# Altium schematic sheet SIM800C_V1.2.SchDoc
size A4
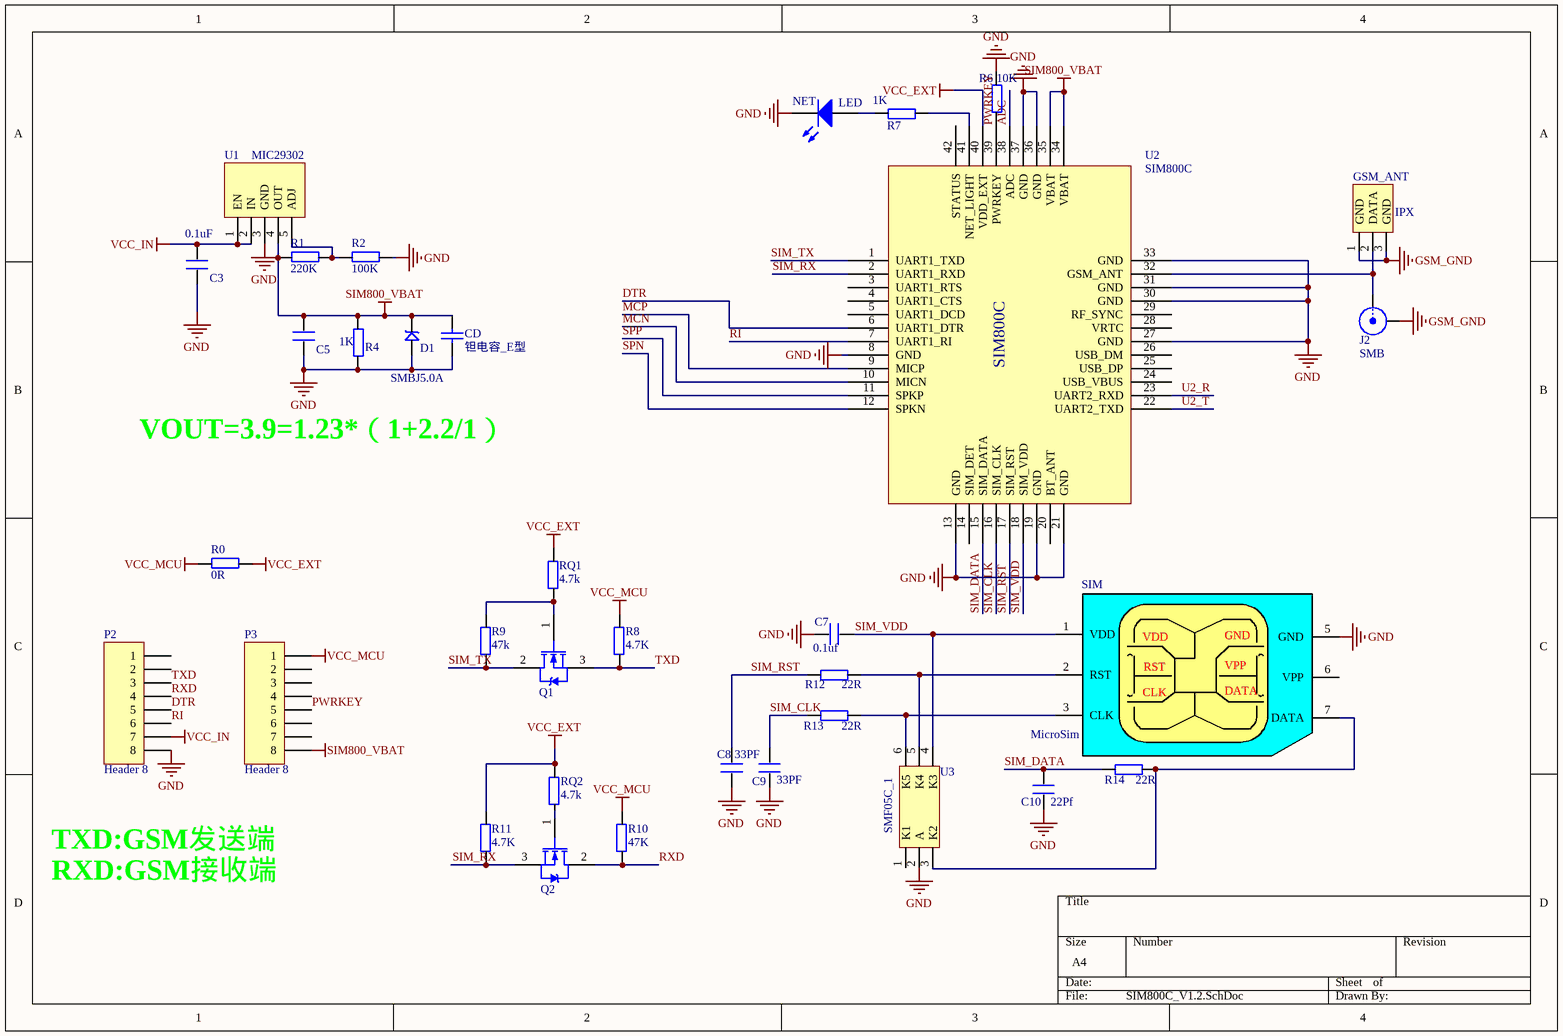
[diagram p0: SIM800C_V1.2.SchDoc]

## Parts
C3  0.1uF  [0603P]
C5  0.1uF  [0603P]  (value not drawn)
C7  0.1uf  [0603P]
C8  22UF  [0603P]  (value not drawn)
C9  22UF  [0603P]  (value not drawn)
C10  22Pf  [0603P]
CD  钽电容_E型  [钽电容_E型]
D1  SMBJ5.0A  [SMBJ]
GSM_ANT  IPX  [IPX]
J2  SMB  [SMB_V-RJ45]
NET  LED  [SMDLED]
P2  Header 8  [HDR1X8]
P3  Header 8  [HDR1X8]
Q1  NMOS-2  [SOT-23]  (value not drawn)
Q2  NMOS-2  [SOT-23]  (value not drawn)
R0  0R  [0603P]
R1  220K  [0603P]
R2  100K  [0603P]
R4  1K  [0603P]
R6  10K  [0603P]
R7  1K  [0603P]
R8  4.7K  [0603P]
R9  47k  [0603P]
R10  47K  [0603P]
R11  4.7K  [0603P]
R12  22R  [0603P]
R13  22R  [0603P]
R14  22R  [0603P]
RQ1  4.7k  [0603P]
RQ2  4.7k  [0603P]
SIM  MicroSim  [SIM卡 自弹]
U1  MIC29302  [D2PAK]
U2  SIM800C  [SIM800C]
U3  SMF05C_1  [SOT-363]

## Nets
GND: C3.1 C5.2 C7.1 C8.1 C9.1 C10.1 CD.1 D1.1 NET.2(K) P2.8 R2.1 R4.1 R6.2 SIM.5(GND) U1.3(GND) U2.8(GND) U2.13(GND) U2.19(GND) U2.21(GND) U2.27(GND) U2.30(GND) U2.31(GND) U2.33(GND) U2.36(GND) U2.37(GND) U3.2(A)
GSM_GND: GSM_ANT.1(GND) GSM_ANT.3(GND) J2.2(Y)
SIM800_VBAT: C5.1 CD.2 D1.2 P3.8 R1.2 R4.2 U1.4(OUT) U2.34(VBAT) U2.35(VBAT)
VCC_EXT: R0.1 R11.2 RQ1.2 RQ2.2 U2.40(VDD_EXT)
VCC_IN: C3.2 P2.7 U1.1(EN) U1.2(IN)
VCC_MCU: P3.1 R0.2 R8.2 R10.2
ADC: U2.38(ADC)
DTR: P2.5 U2.6(UART1_DTR)
MCN: U2.10(MICN)
MCP: U2.9(MICP)
PWRKEY: P3.5 R6.1 U2.39(PWRKEY)
RI: P2.6 U2.7(UART1_RI)
RXD: P2.4 Q2.2(D) R10.1
SIM_CLK: C9.2 R13.1 U2.16(SIM_CLK)
SIM_DATA: C10.2 R14.1 U2.15(SIM_DATA)
SIM_RST: C8.2 R12.1 U2.17(SIM_RST)
SIM_RX: Q2.3(S) R11.1 U2.2(UART1_RXD)
SIM_TX: Q1.2(D) R9.1 U2.1(UART1_TXD)
SIM_VDD: C7.2 SIM.1(VDD) U2.18(SIM_VDD) U3.4(K3)
SPN: U2.12(SPKN)
SPP: U2.11(SPKP)
TXD: P2.3 Q1.3(S) R8.1
U2_R: U2.23(UART2_RXD)
U2_T: U2.22(UART2_TXD)
NetGSM_ANT_2: GSM_ANT.2(DATA) J2.1(X) U2.32(GSM_ANT)
NetNET_1: NET.1(A) R7.1
NetQ1_1: Q1.1(G) R9.2 RQ1.1
NetQ2_1: Q2.1(G) RQ2.1
NetR1_1: R1.1 R2.2 U1.5(ADJ)
NetR7_2: R7.2 U2.41(NET_LIGHT)
NetR12_2: R12.2 SIM.2(RST) U3.5(K4)
NetR13_2: R13.2 SIM.3(CLK) U3.6(K5)
NetR14_2: R14.2 SIM.7(DATA) U3.3(K2)

Not connected (* = marked no-connect by the designer): P2 1 2; P3 2 3 4 6 7; SIM 6(VPP); U2 3(UART1_RTS) 4(UART1_CTS) 5(UART1_DCD) 14(SIM_DET) 20(BT_ANT) 24(USB_VBUS) 25(USB_DP) 26(USB_DM) 28(VRTC) 29(RF_SYNC) 42(STATUS); U3 1(K1)

## Notes on the sheet
- VOUT=3.9=1.23*（1+2.2/1）
- TXD:GSM发送端
- RXD:GSM接收端
- (in symbol C) 33PF

## Library data of the parts
C3 C7-C10 = C
C5 = C_2
D1 = SMBJ: TVS
GSM_ANT = IPEX: IPEX座
J2 = SMB: SMB Straight Connector; LatestRevisionDate: 17-Jul-2002; LatestRevisionNote: Re-released for DXP Platform.; Publisher: Altium Limited
NET = LED2: Typical RED, GREEN, YELLOW, AMBER GaAs LED; Published: 8-Jun-2000; LatestRevisionDate: 17-Jul-2002; LatestRevisionNote: Re-released for DXP Platform.; PackageDocument: Feb-2002; PackageReference: 3.2X1.6X1.1; Publisher: Altium Limited
P2 P3 = Header 8: Header, 8-Pin; LatestRevisionDate: 17-Jul-2002; LatestRevisionNote: Re-released for DXP Platform.; Publisher: Altium Limited
Q1 Q2 = NMOS-2: N-Channel Power MOSFET; Note: Pin 2 is electrically connected to pin 4.; Published: 8-Jun-2000; LatestRevisionDate: 17-Jul-2002; LatestRevisionNote: Re-released for DXP Platform.; DatasheetDocument: PD-9.814; PackageReference: TO-220AB; Publisher: Altium Limited; Code_JEDEC: TO-220-AB; ComponentLink1Description: Manufacturer Link; ComponentLink1URL: http://www.irf.com/
R0-R2 R4 R6-R14 RQ1 RQ2 = R
SIM = SIM卡 自弹
U3 = SMF05C_1: TVS